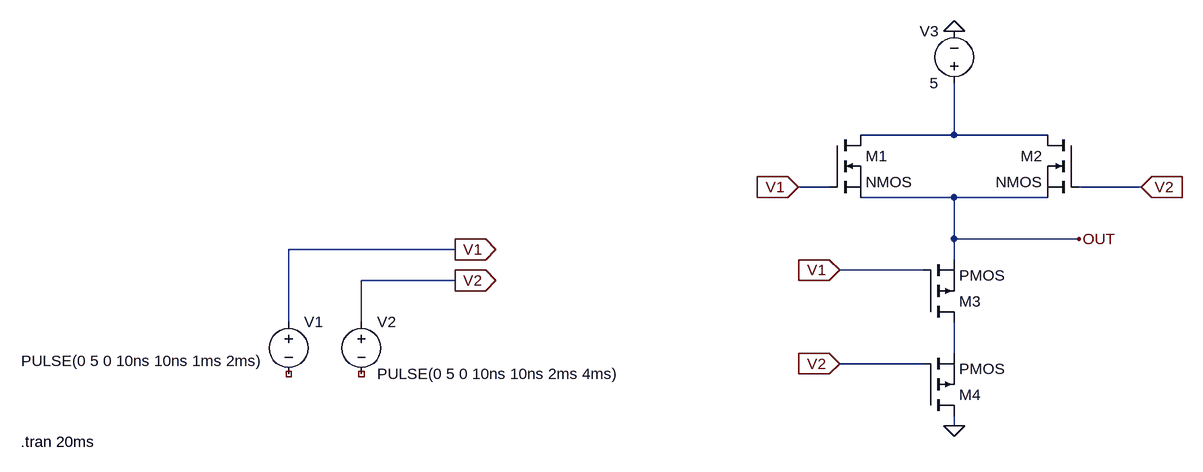
[diagram p0: schematic OR_gate.asc]
OR_gate.asc, the LTspice schematic file:
Version 4
SHEET 1 1304 680
WIRE 928 -96 928 -176
WIRE 928 -96 784 -96
WIRE 1072 -96 928 -96
WIRE 736 -16 688 -16
WIRE 1216 -16 1120 -16
WIRE 928 0 784 0
WIRE 1072 0 928 0
WIRE 928 64 928 0
WIRE 1120 64 928 64
WIRE 160 80 -96 80
WIRE 928 96 928 64
WIRE 880 112 752 112
WIRE 160 128 16 128
WIRE -96 192 -96 80
WIRE 16 192 16 128
WIRE 928 240 928 192
WIRE 880 256 752 256
WIRE 928 352 928 336
FLAG 160 80 V1
IOPIN 160 80 Out
FLAG 160 128 V2
IOPIN 160 128 Out
FLAG 928 352 0
FLAG 928 -256 0
FLAG 1216 -16 V2
IOPIN 1216 -16 In
FLAG 688 -16 V1
IOPIN 688 -16 In
FLAG 752 112 V1
IOPIN 752 112 In
FLAG 752 256 V2
IOPIN 752 256 In
FLAG 1120 64 OUT
SYMBOL voltage -96 176 R0
WINDOW 3 -411 76 Left 2
WINDOW 123 0 0 Left 0
WINDOW 39 0 0 Left 0
SYMATTR InstName V1
SYMATTR Value PULSE(0 5 0 10ns 10ns 1ms 2ms)
SYMBOL voltage 16 176 R0
WINDOW 123 0 0 Left 0
WINDOW 39 0 0 Left 0
SYMATTR InstName V2
SYMATTR Value PULSE(0 5 0 10ns 10ns 2ms 4ms)
SYMBOL voltage 928 -160 R180
WINDOW 0 24 96 Left 2
WINDOW 3 24 16 Left 2
WINDOW 123 0 0 Left 0
WINDOW 39 0 0 Left 0
SYMATTR InstName V3
SYMATTR Value 5
SYMBOL nmos 736 -96 R0
SYMATTR InstName M1
SYMBOL nmos 1120 -96 M0
SYMATTR InstName M2
SYMBOL pmos 880 192 M180
SYMATTR InstName M3
SYMBOL pmos 880 336 M180
SYMATTR InstName M4
TEXT -508 376 Left 2 !.tran 20ms

The netlist it stands for:
* OR_gate.asc
V1 V1 NC_01 PULSE(0 5 0 10ns 10ns 1ms 2ms)
V2 V2 NC_02 PULSE(0 5 0 10ns 10ns 2ms 4ms)
V3 N001 0 5
M1 N001 V1 OUT OUT NMOS
M2 N001 V2 OUT OUT NMOS
M3 N002 V1 OUT OUT PMOS
M4 0 V2 N002 N002 PMOS
.model NMOS NMOS
.model PMOS PMOS
.lib standard.mos
.tran 20ms
.backanno
.end